# EAGLE schematic can_hub_v1 (EAGLE 6.4)
DATABASE: ./../../dossant-PARTSDB.txt
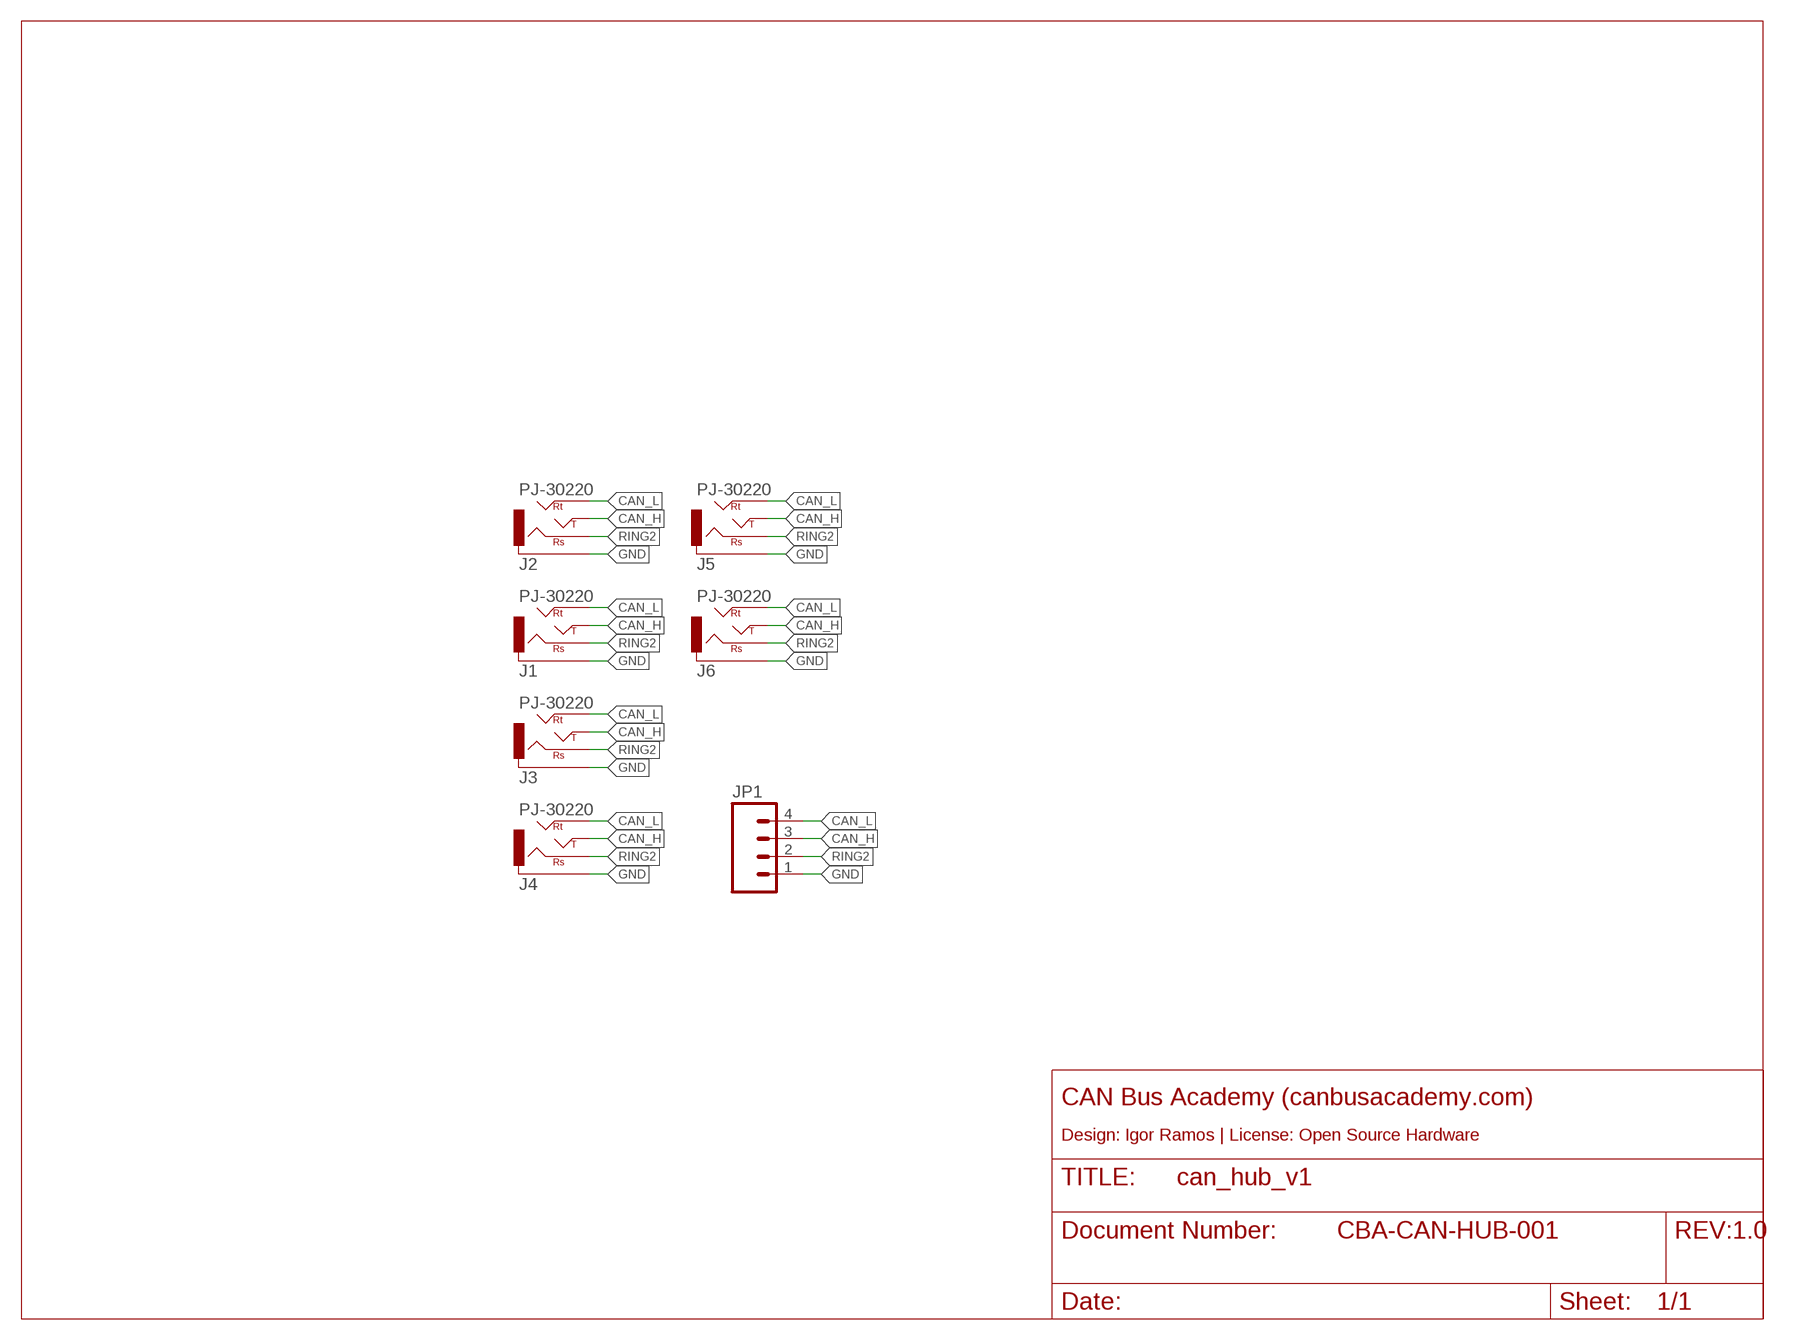
[diagram p0: schematic, sheet 1]

## Parts
J1  PJ-30220  AUDIO_JACK_4POSA  [PJ-30220]
J2  PJ-30220  AUDIO_JACK_4POSA  [PJ-30220]
J3  PJ-30220  AUDIO_JACK_4POSA  [PJ-30220]
J4  PJ-30220  AUDIO_JACK_4POSA  [PJ-30220]
J5  PJ-30220  AUDIO_JACK_4POSA  [PJ-30220]
J6  PJ-30220  AUDIO_JACK_4POSA  [PJ-30220]
JP1  M04PTH  [1X04]

## Nets
CAN_H: J1.P$03(TIP) J1.P$03B(TIP) J2.P$03(TIP) J2.P$03B(TIP) J3.P$03(TIP) J3.P$03B(TIP) J4.P$03(TIP) J4.P$03B(TIP) J5.P$03(TIP) J5.P$03B(TIP) J6.P$03(TIP) J6.P$03B(TIP) JP1.3
CAN_L: J1.P$04(RT) J2.P$04(RT) J3.P$04(RT) J4.P$04(RT) J5.P$04(RT) J6.P$04(RT) JP1.4
GND: J1.P$01(SLEEVE) J2.P$01(SLEEVE) J3.P$01(SLEEVE) J4.P$01(SLEEVE) J5.P$01(SLEEVE) J6.P$01(SLEEVE) JP1.1
RING2: J1.P$02(RS) J2.P$02(RS) J3.P$02(RS) J4.P$02(RS) J5.P$02(RS) J6.P$02(RS) JP1.2

## Notes on the sheet
- CAN Bus Academy (canbusacademy.com)
- Design: Igor Ramos | License: Open Source Hardware
- CBA-CAN-HUB-001 | 1.0

## Library data of the parts
J1-J6 = igor_lib_6d4d0:AUDIO_JACK_4POS: updated as of 5/4/2013. v1: initial v2: swapped tip and rt based on bad cable, reduced hole diam. v3: swapped RS and RT and added tName pinout; PARTNO: PJ30220
JP1 = SparkFun:M04: Header 4 Standard 4-pin 0.1" header. Use with straight break away headers (SKU : PRT-00116), right angle break away headers (PRT-00553), swiss pins (PRT-00743), machine pins (PRT-00117), and female headers (PRT-00115). Molex polarized connector foot print use with SKU : PRT-08231 with associated crimp pins and housings. 1MM SMD Version SKU: PRT-10208